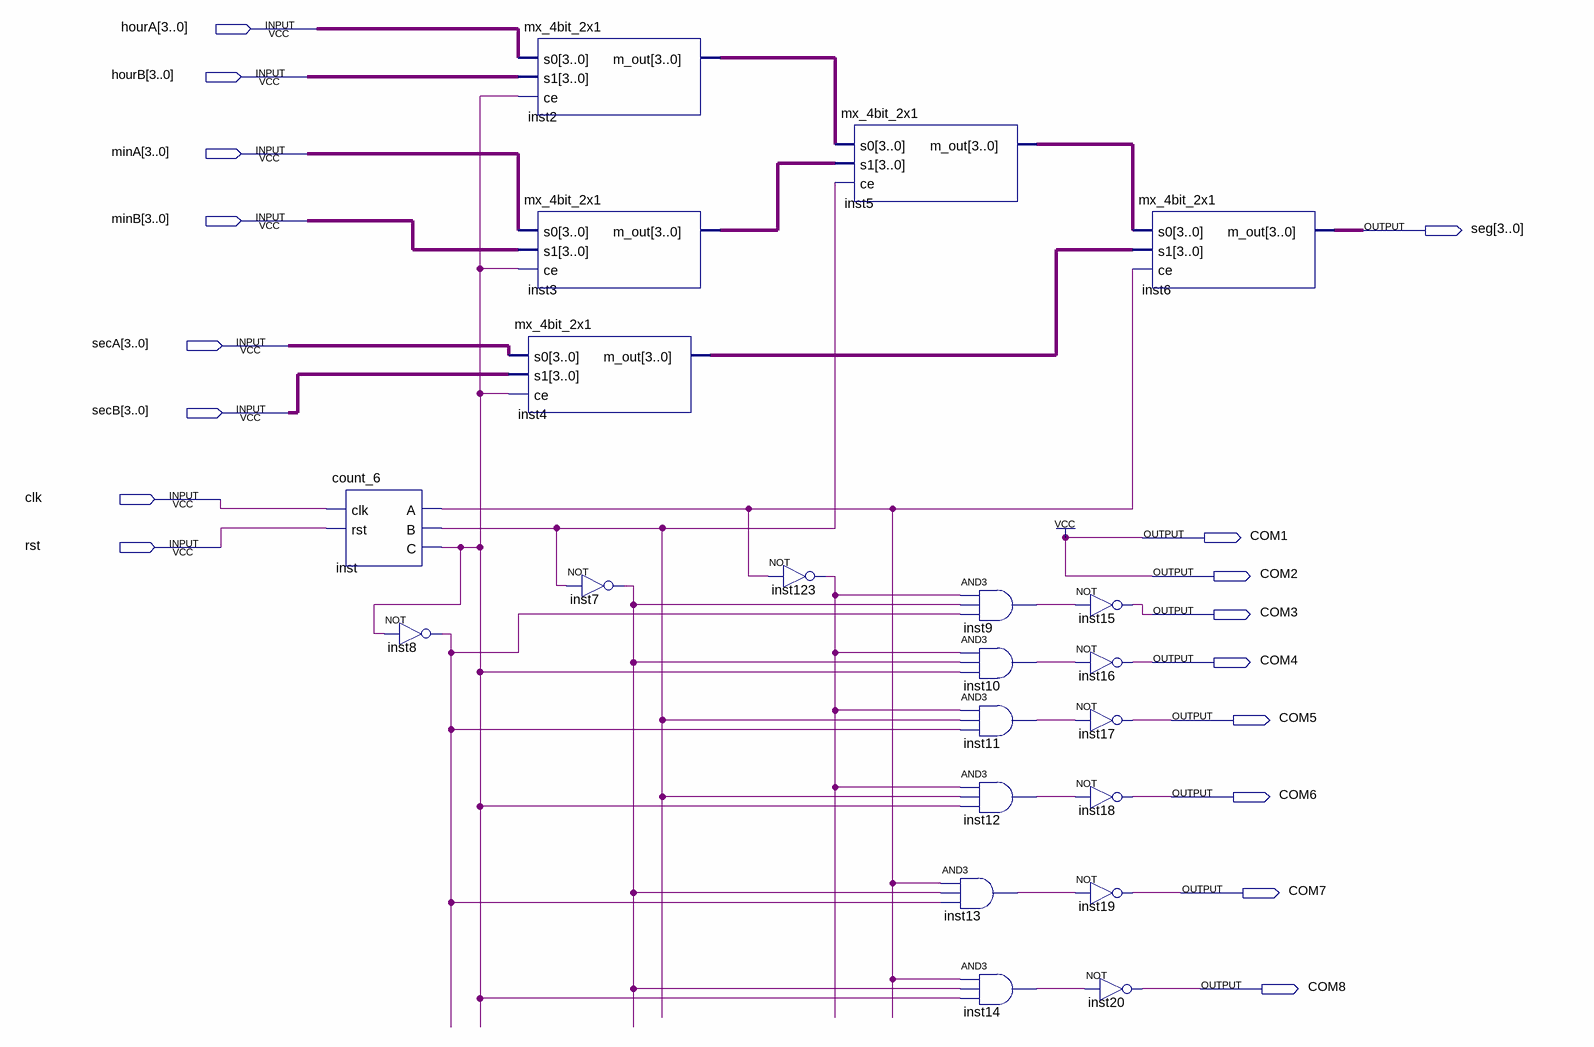
[diagram p0: schematic sheet]
// Quartus schematic six_row_segment.bdf as structural Verilog: 21 symbols, 17 pins
module six_row_segment (
  input  [3:0] hourA,
  input  [3:0] hourB,
  input  [3:0] minA,
  input  [3:0] minB,
  input  [3:0] secA,
  input  [3:0] secB,
  input  clk,
  input  rst,
  output [3:0] seg,
  output COM1,
  output COM2,
  output COM3,
  output COM4,
  output COM5,
  output COM6,
  output COM7,
  output COM8
);

  wire inst7_out, inst8_out, inst9_out, inst10_out, inst11_out, inst12_out, inst13_out, inst14_out,
       inst123_out, inst_a, inst_b, inst_c;
  wire [3:0] inst2_m_out, inst3_m_out, inst4_m_out, inst5_m_out;

  count_6 inst (.clk(clk), .rst(rst), .A(inst_a), .B(inst_b), .C(inst_c));
  not inst8 (inst8_out, inst_c);
  mx_4bit_2x1 inst2 (.s0(hourA), .s1(hourB), .ce(inst_c), .m_out(inst2_m_out));
  mx_4bit_2x1 inst3 (.s0(minA), .s1(minB), .ce(inst_c), .m_out(inst3_m_out));
  mx_4bit_2x1 inst4 (.s0(secA), .s1(secB), .ce(inst_c), .m_out(inst4_m_out));
  not inst7 (inst7_out, inst_b);
  not inst123 (inst123_out, inst_a);
  mx_4bit_2x1 inst5 (.s0(inst2_m_out), .s1(inst3_m_out), .ce(inst_b), .m_out(inst5_m_out));
  and inst13 (inst13_out, inst_a, inst7_out, inst8_out);
  and inst9 (inst9_out, inst123_out, inst7_out, inst8_out);
  and inst10 (inst10_out, inst123_out, inst7_out, inst_c);
  and inst11 (inst11_out, inst123_out, inst_b, inst8_out);
  and inst12 (inst12_out, inst123_out, inst_b, inst_c);
  and inst14 (inst14_out, inst_a, inst7_out, inst_c);
  not inst15 (COM3, inst9_out);
  not inst16 (COM4, inst10_out);
  not inst17 (COM5, inst11_out);
  not inst18 (COM6, inst12_out);
  not inst19 (COM7, inst13_out);
  not inst20 (COM8, inst14_out);
  mx_4bit_2x1 inst6 (.s0(inst5_m_out), .s1(inst4_m_out), .ce(inst_a), .m_out(seg));

  assign COM1 = 1'b1;
  assign COM2 = 1'b1;
endmodule
